# Altium schematic sheet Power_Brick_Tester.SchDoc
size A4
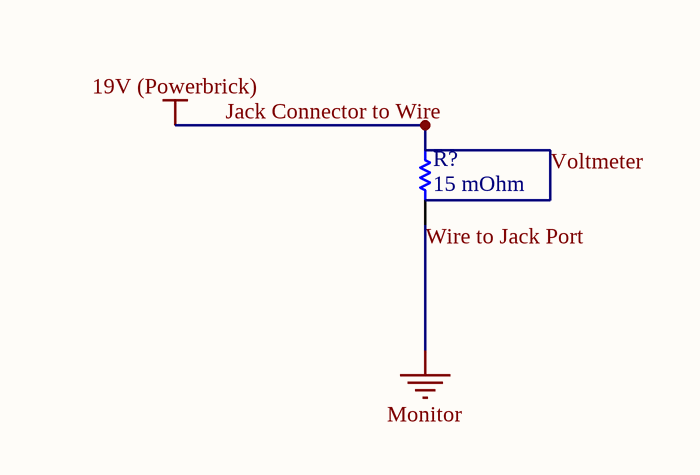
[diagram p0: Power_Brick_Tester.SchDoc]

## Parts
R?  15 mOhm  [RES 2818]

## Nets
Jack Connector to Wire: R?.1  [also labelled 19V (Powerbrick), Voltmeter]
Wire to Jack Port: R?.2  [also labelled Monitor]

## Library data of the parts
R? = RES 0.015 OHM 1% 7W 2818: 15 mOhms ±1% 7W Chip Resistor Nonstandard Automotive AEC-Q200, Current Sense, Moisture Resistant, Pulse Withstanding Metal Element; ComponentLink1URL: http://www.mouser.com/ds/2/427/wshm2818-469484.pdf; ComponentLink1Description: http://www.mouser.com/ds/2/427/wshm2818-469484.pdf; ComponentLink2URL: http://www.vishay.com/docs/49536/_wshm2818_vmn-pt0284.pdf; ComponentLink2Description: http://www.vishay.com/docs/49536/_wshm2818_vmn-pt0284.pdf; ComponentLink3URL: http://www.vishay.com/docs/30188/wshm2818.pdf; ComponentLink3Description: http://www.vishay.com/docs/30188/wshm2818.pdf